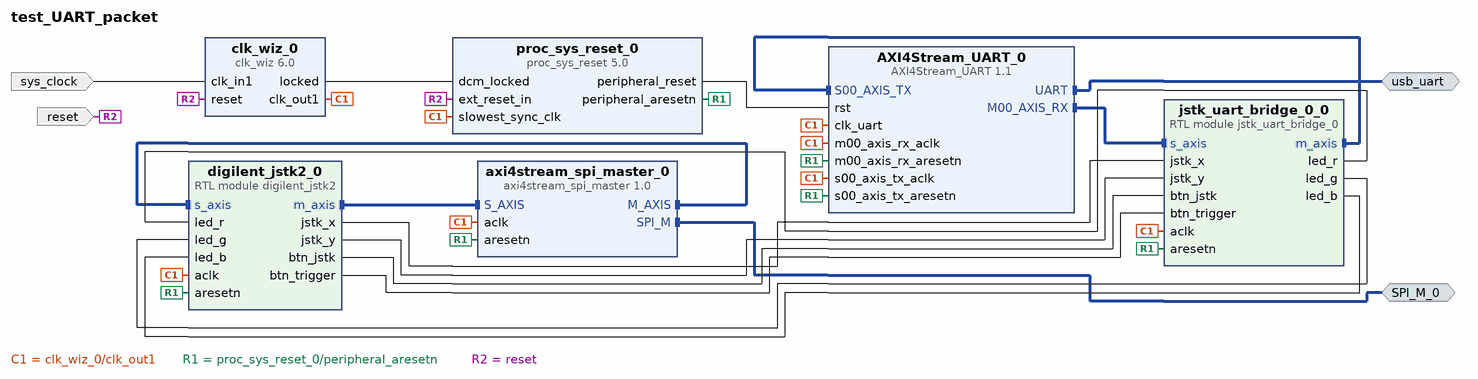
[diagram p0: block diagram of the top level]
# Vivado block design test_UART_packet, xc7a35tcpg236-1, Vivado 2020.2
create_bd_design test_UART_packet

create_bd_intf_port -mode Master -vlnv xilinx.com:interface:spi_rtl:1.0 SPI_M_0
create_bd_intf_port -mode Master -vlnv xilinx.com:interface:uart_rtl:1.0 usb_uart
create_bd_port -dir I -type clk sys_clock
set_property -dict {CONFIG.FREQ_HZ 100000000 CONFIG.PHASE 0.000} [get_bd_ports sys_clock]
create_bd_port -dir I -type rst reset
set_property -dict {CONFIG.POLARITY ACTIVE_HIGH} [get_bd_ports reset]

create_bd_cell -type ip -vlnv xilinx.com:ip:proc_sys_reset:5.0 proc_sys_reset_0
create_bd_cell -type ip -vlnv DigiLAB:ip:AXI4Stream_UART:1.1 AXI4Stream_UART_0
set_property -dict {CONFIG.UART_BOARD_INTERFACE usb_uart CONFIG.USE_BOARD_FLOW true} [get_bd_cells AXI4Stream_UART_0]
create_bd_cell -type ip -vlnv DigiLAB:ip:axi4stream_spi_master:1.0 axi4stream_spi_master_0
set_property -dict {CONFIG.c_clkfreq 100000000 CONFIG.c_sclkfreq 5000} [get_bd_cells axi4stream_spi_master_0]
create_bd_cell -type ip -vlnv xilinx.com:ip:clk_wiz:6.0 clk_wiz_0
set_property -dict [list \
  CONFIG.CLKOUT1_JITTER 130.958 \
  CONFIG.CLKOUT1_REQUESTED_OUT_FREQ 100.000 \
  CONFIG.CLK_IN1_BOARD_INTERFACE sys_clock \
  CONFIG.MMCM_CLKOUT0_DIVIDE_F 10.000 \
  CONFIG.RESET_BOARD_INTERFACE reset \
  CONFIG.USE_BOARD_FLOW true \
] [get_bd_cells clk_wiz_0]
create_bd_cell -type module -reference jstk_uart_bridge_0 jstk_uart_bridge_0_0
create_bd_cell -type module -reference digilent_jstk2 digilent_jstk2_0

# ---- connections ----

connect_bd_intf_net [get_bd_intf_pins jstk_uart_bridge_0_0/s_axis] [get_bd_intf_pins AXI4Stream_UART_0/M00_AXIS_RX]
connect_bd_intf_net [get_bd_intf_pins digilent_jstk2_0/s_axis] [get_bd_intf_pins axi4stream_spi_master_0/M_AXIS]
connect_bd_intf_net [get_bd_intf_pins AXI4Stream_UART_0/S00_AXIS_TX] [get_bd_intf_pins jstk_uart_bridge_0_0/m_axis]
connect_bd_intf_net [get_bd_intf_pins digilent_jstk2_0/m_axis] [get_bd_intf_pins axi4stream_spi_master_0/S_AXIS]
connect_bd_intf_net [get_bd_intf_ports SPI_M_0] [get_bd_intf_pins axi4stream_spi_master_0/SPI_M]
connect_bd_intf_net [get_bd_intf_ports usb_uart] [get_bd_intf_pins AXI4Stream_UART_0/UART]
connect_bd_net [get_bd_pins clk_wiz_0/clk_out1] \
  [get_bd_pins proc_sys_reset_0/slowest_sync_clk] [get_bd_pins axi4stream_spi_master_0/aclk] \
  [get_bd_pins AXI4Stream_UART_0/m00_axis_rx_aclk] [get_bd_pins AXI4Stream_UART_0/s00_axis_tx_aclk] \
  [get_bd_pins AXI4Stream_UART_0/clk_uart] [get_bd_pins jstk_uart_bridge_0_0/aclk] [get_bd_pins digilent_jstk2_0/aclk]
connect_bd_net [get_bd_pins proc_sys_reset_0/peripheral_aresetn] \
  [get_bd_pins AXI4Stream_UART_0/m00_axis_rx_aresetn] [get_bd_pins AXI4Stream_UART_0/s00_axis_tx_aresetn] \
  [get_bd_pins axi4stream_spi_master_0/aresetn] [get_bd_pins jstk_uart_bridge_0_0/aresetn] \
  [get_bd_pins digilent_jstk2_0/aresetn]
connect_bd_net [get_bd_pins proc_sys_reset_0/peripheral_reset] [get_bd_pins AXI4Stream_UART_0/rst]
connect_bd_net [get_bd_pins digilent_jstk2_0/jstk_x] [get_bd_pins jstk_uart_bridge_0_0/jstk_x]
connect_bd_net [get_bd_pins digilent_jstk2_0/jstk_y] [get_bd_pins jstk_uart_bridge_0_0/jstk_y]
connect_bd_net [get_bd_pins digilent_jstk2_0/btn_jstk] [get_bd_pins jstk_uart_bridge_0_0/btn_jstk]
connect_bd_net [get_bd_pins digilent_jstk2_0/btn_trigger] [get_bd_pins jstk_uart_bridge_0_0/btn_trigger]
connect_bd_net [get_bd_ports sys_clock] [get_bd_pins clk_wiz_0/clk_in1]
connect_bd_net [get_bd_pins clk_wiz_0/locked] [get_bd_pins proc_sys_reset_0/dcm_locked]
connect_bd_net [get_bd_ports reset] [get_bd_pins clk_wiz_0/reset] [get_bd_pins proc_sys_reset_0/ext_reset_in]
connect_bd_net [get_bd_pins jstk_uart_bridge_0_0/led_r] [get_bd_pins digilent_jstk2_0/led_r]
connect_bd_net [get_bd_pins jstk_uart_bridge_0_0/led_g] [get_bd_pins digilent_jstk2_0/led_g]
connect_bd_net [get_bd_pins jstk_uart_bridge_0_0/led_b] [get_bd_pins digilent_jstk2_0/led_b]

validate_bd_design
save_bd_design
